# Altium schematic sheet PM2565.SchDoc
size A4
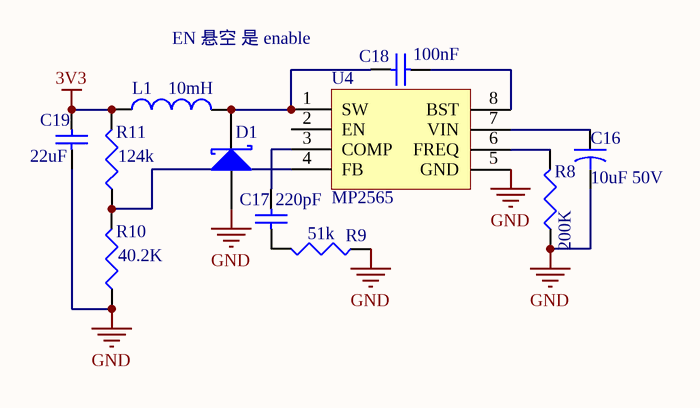
[diagram p0: PM2565.SchDoc]

## Parts
C16  value 10uF 50V  [CAPR5-4X5]
C17  value 220pF  [0603_C]
C18  value 100nF  [0603_C]
C19  value 22uF  [0603_C]
D1  (no value)  [B380]
L1  value 10mH  [B380]
R8  value 200K  [0603_R]
R9  value 51k  [0603_R]
R10  value 40.2K  [0603_R]
R11  value 124k  [0603_R]
U4  MP2565  [SOIC8E]

## Nets
3V3: C19.2 L1.1 R11.2
GND: C16.2 C19.1 D1.1(A) R8.1 R9.1 R10.1 U4.5(GND)
NetC16_1: C16.1 U4.7(VIN)
NetC17_1: C17.1 R9.2
NetC17_2: C17.2 U4.3(COMP)
NetC18_1: C18.1 U4.8(BST)
NetC18_2: C18.2 D1.2(K) L1.2 U4.1(SW)
NetR8_2: R8.2 U4.6(FREQ)
NetR10_2: R10.2 R11.1 U4.4(FB)

Not connected (* = marked no-connect by the designer): U4 2(EN)

## Notes on the sheet
- EN 悬空 是 enable

## Library data of the parts
C16 = Cap2: Capacitor; Published: 23-Sep-2002; PackageReference: CAPR5-4X5; Publisher: Altium Limited; PackageDescription: Capacitor; 2 Leads
C17-C19 = Cap: Published: 8-Jun-2000; LatestRevisionDate: 29-May-2009; LatestRevisionNote: IPC-7351 Footprint Added.; PackageReference: C1206; Publisher: Altium Limited; PackageDescription: Chip Capacitor
D1 = D Schottky: Schottky Diode; Published: 8-Jun-2000; LatestRevisionDate: 17-Jul-2002; LatestRevisionNote: Re-released for DXP Platform.; PackageReference: SMB; Publisher: Altium Limited; PackageDescription: DO-214-AA/SMB; 2 C-Bend Leads; Body 5.3 x 3.6 mm, inc. leads (LxW); Code_JEDEC: DO-214-AA
L1 = Ind: Inductor; Code_IEC: 1005; Published: 8-Jun-2000; LatestRevisionDate: 29-May-2009; LatestRevisionNote: IPC-7351 Footprint Added.; PackageReference: 0402-A; Publisher: Altium Limited; PackageDescription: Chip Inductor; Code_JEITA: 0402
R8-R11 = Res: Published: 8-Jun-2000; LatestRevisionDate: 29-May-2009; LatestRevisionNote: IPC-7351 Footprint Added.; PackageReference: J1-0603; Publisher: Altium Limited; PackageDescription: Chip Resistor
U4 = MP2565: 50V  Step-Down Converter